# Altium schematic sheet TopLevel.SchDoc: TopLevel
size A4; ApprovedBy: Self; CheckedBy: Self; CompanyName: TAISAT; DrawnBy: Alperen FENERCİ; Organization: IKA; SheetNumber: 1; SheetTotal: 6
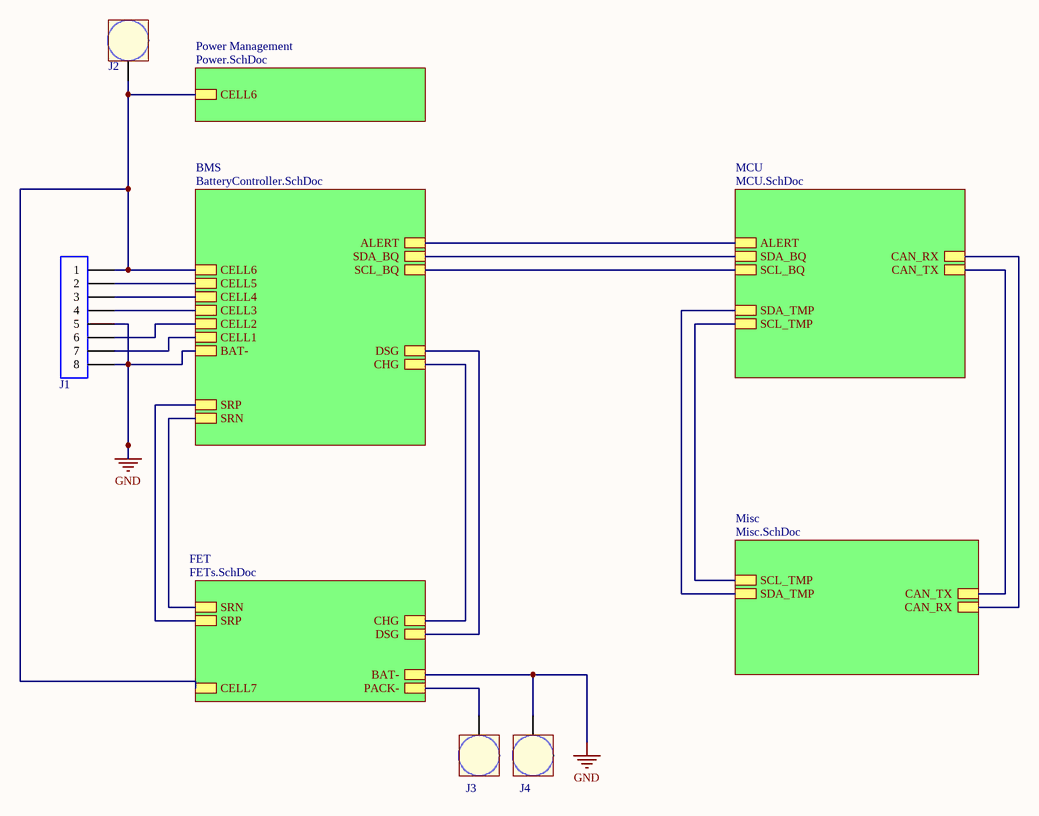
[diagram p0: TopLevel.SchDoc]

## Parts
J1  HEADER-MALE-SMT-90C-4COL-2ROW  [0430450810]  (value not drawn)
J2  7460305  [7460305]  (value not drawn)
J3  7460305  [7460305]  (value not drawn)
J4  7460305  [7460305]  (value not drawn)

## Sub-sheets
BMS = BatteryController.SchDoc: CELL1, BAT-, CELL2, CELL3, CELL4, CELL5, CELL6, SCL_BQ, SDA_BQ, CHG, DSG, ALERT, SRN, SRP
FET = FETs.SchDoc: CHG, DSG, PACK-, BAT-, SRN, SRP, CELL7
MCU = MCU.SchDoc: SCL_BQ, SDA_BQ, ALERT, SCL_TMP, SDA_TMP, CAN_RX, CAN_TX
Misc = Misc.SchDoc: CAN_RX, CAN_TX, SCL_TMP, SDA_TMP
Power Management = Power.SchDoc: CELL6

## Nets
GND: J1.5 J1.8 J4.1 ; sheet BMS/BAT-, sheet FET/BAT-
NetJ1_1: J1.1 J2.1 ; sheet BMS/CELL6, sheet FET/CELL7, sheet Power Management/CELL6
NetJ1_2: J1.2 ; sheet BMS/CELL5
NetJ1_3: J1.3 ; sheet BMS/CELL4
NetJ1_4: J1.4 ; sheet BMS/CELL3
NetJ1_6: J1.6 ; sheet BMS/CELL2
NetJ1_7: J1.7 ; sheet BMS/CELL1
NetJ3_1: J3.1 ; sheet FET/PACK-
(unnamed): sheet BMS/SCL_BQ, sheet MCU/SCL_BQ
(unnamed): sheet BMS/SDA_BQ, sheet MCU/SDA_BQ
(unnamed): sheet BMS/CHG, sheet FET/CHG
(unnamed): sheet BMS/DSG, sheet FET/DSG
(unnamed): sheet BMS/ALERT, sheet MCU/ALERT
(unnamed): sheet BMS/SRN, sheet FET/SRN
(unnamed): sheet BMS/SRP, sheet FET/SRP
(unnamed): sheet MCU/SCL_TMP, sheet Misc/SCL_TMP
(unnamed): sheet MCU/SDA_TMP, sheet Misc/SDA_TMP
(unnamed): sheet MCU/CAN_RX, sheet Misc/CAN_RX
(unnamed): sheet MCU/CAN_TX, sheet Misc/CAN_TX

## Notes on the sheet
- Dosya Adı / File Name
- Proje Adı / Project Name
- Sayfa Adı / Sheet Name
- Şirket Adı / Company Name
- Tasarlayan / Designed By
- Takım / Team
- Kontrol Eden / Checked By
- Başlangıç Tarihi / Start Date
- Revize Tarihi / Revision Date
- Onaylayan / Approved By
- Sayfa / Sheet

## Library data of the parts
J1 = 0430450810: Connector; Pin Rows: 2; Pin Positions: 8; Contact Type: Male; ComponentLink1Description: Digikey; ComponentLink1URL: https://www.digikey.com/en/products/detail/molex/0430450810/2404815?s=N4IgTCBcDaIAwBYDMiCscAcBGOIC6AvkA; ComponentLink2Description: Ozdisan; ComponentLink2URL: https://ozdisan.com/connectors-and-interconnects/rectangular-connectors/pcb-connectors/L-KLS1-XM1-3-00-2X04-RT/512932; ComponentLink3Description: Datasheet; ComponentLink3URL: https://www.molex.com/en-us/products/part-detail/430450810?display=pdf; Case/Package: SMD; ComponentLink4Description: Datasheet; ComponentLink4URL: https://cdn.ozdisan.com/ETicaret_Dosya/482201_886496495..pdf
J2-J4 = 7460305: Connector